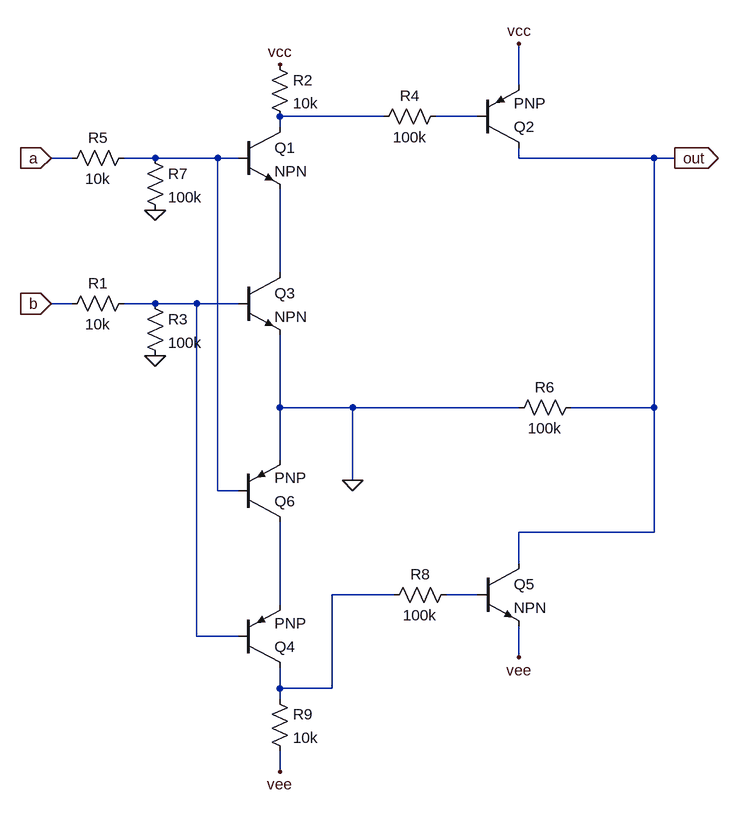
[diagram p0: schematic TAND.asc]
TAND.asc, the LTspice schematic file:
Version 4
SHEET 1 1456 780
WIRE -176 -928 -176 -992
WIRE -384 -880 -544 -880
WIRE -240 -880 -304 -880
WIRE -544 -864 -544 -880
WIRE -864 -816 -896 -816
WIRE -736 -816 -784 -816
WIRE -640 -816 -736 -816
WIRE -608 -816 -640 -816
WIRE -176 -816 -176 -832
WIRE 32 -816 -176 -816
WIRE 64 -816 32 -816
WIRE -544 -640 -544 -768
WIRE -864 -592 -896 -592
WIRE -736 -592 -784 -592
WIRE -672 -592 -736 -592
WIRE -608 -592 -672 -592
WIRE -544 -432 -544 -544
WIRE -432 -432 -544 -432
WIRE -176 -432 -432 -432
WIRE 32 -432 32 -816
WIRE 32 -432 -96 -432
WIRE -544 -352 -544 -432
WIRE -432 -320 -432 -432
WIRE -640 -304 -640 -816
WIRE -608 -304 -640 -304
WIRE 32 -240 32 -432
WIRE 32 -240 -176 -240
WIRE -176 -192 -176 -240
WIRE -368 -144 -464 -144
WIRE -240 -144 -288 -144
WIRE -544 -128 -544 -256
WIRE -672 -80 -672 -592
WIRE -608 -80 -672 -80
WIRE -176 -48 -176 -96
WIRE -544 0 -544 -32
WIRE -464 0 -464 -144
WIRE -464 0 -544 0
WIRE -544 16 -544 0
WIRE -544 128 -544 96
FLAG 64 -816 out
IOPIN 64 -816 Out
FLAG -544 -960 vcc
FLAG -176 -992 vcc
FLAG -896 -816 a
IOPIN -896 -816 In
FLAG -736 -736 0
FLAG -896 -592 b
IOPIN -896 -592 In
FLAG -736 -512 0
FLAG -544 128 vee
FLAG -176 -48 vee
FLAG -432 -320 0
SYMBOL Res -560 -976 R0
SYMATTR InstName R2
SYMATTR Value 10k
SYMBOL npn -608 -864 R0
SYMATTR InstName Q1
SYMBOL Res -288 -896 R90
WINDOW 0 0 56 VBottom 2
WINDOW 3 32 56 VTop 2
SYMATTR InstName R4
SYMATTR Value 100k
SYMBOL pnp -240 -832 M180
SYMATTR InstName Q2
SYMBOL Res -768 -832 R90
WINDOW 0 0 56 VBottom 2
WINDOW 3 32 56 VTop 2
SYMATTR InstName R5
SYMATTR Value 10k
SYMBOL Res -752 -832 R0
SYMATTR InstName R7
SYMATTR Value 100k
SYMBOL Res -768 -608 R90
WINDOW 0 0 56 VBottom 2
WINDOW 3 32 56 VTop 2
SYMATTR InstName R1
SYMATTR Value 10k
SYMBOL Res -752 -608 R0
SYMATTR InstName R3
SYMATTR Value 100k
SYMBOL npn -608 -640 R0
SYMATTR InstName Q3
SYMBOL Res -272 -160 R90
WINDOW 0 0 56 VBottom 2
WINDOW 3 32 56 VTop 2
SYMATTR InstName R8
SYMATTR Value 100k
SYMBOL Res -560 0 R0
SYMATTR InstName R9
SYMATTR Value 10k
SYMBOL pnp -608 -32 M180
SYMATTR InstName Q4
SYMBOL npn -240 -192 R0
SYMATTR InstName Q5
SYMBOL pnp -608 -256 M180
SYMATTR InstName Q6
SYMBOL Res -80 -448 R90
WINDOW 0 0 56 VBottom 2
WINDOW 3 32 56 VTop 2
SYMATTR InstName R6
SYMATTR Value 100k

The netlist it stands for:
* TAND.asc
R2 vcc N001 10k
Q1 N001 N003 N004 0 NPN
R4 N002 N001 100k
Q2 out N002 vcc 0 PNP
R5 N003 a 10k
R7 N003 0 100k
R1 N005 b 10k
R3 N005 0 100k
Q3 N004 N005 0 0 NPN
R8 N007 N006 100k
R9 N006 vee 10k
Q4 N006 N005 N008 0 PNP
Q5 out N007 vee 0 NPN
Q6 N008 N003 0 0 PNP
R6 out 0 100k
.model NPN NPN
.model PNP PNP
.lib standard.bjt
.backanno
.end